# EAGLE design TDA2822M_SMD Version (EAGLE 7.0.0)
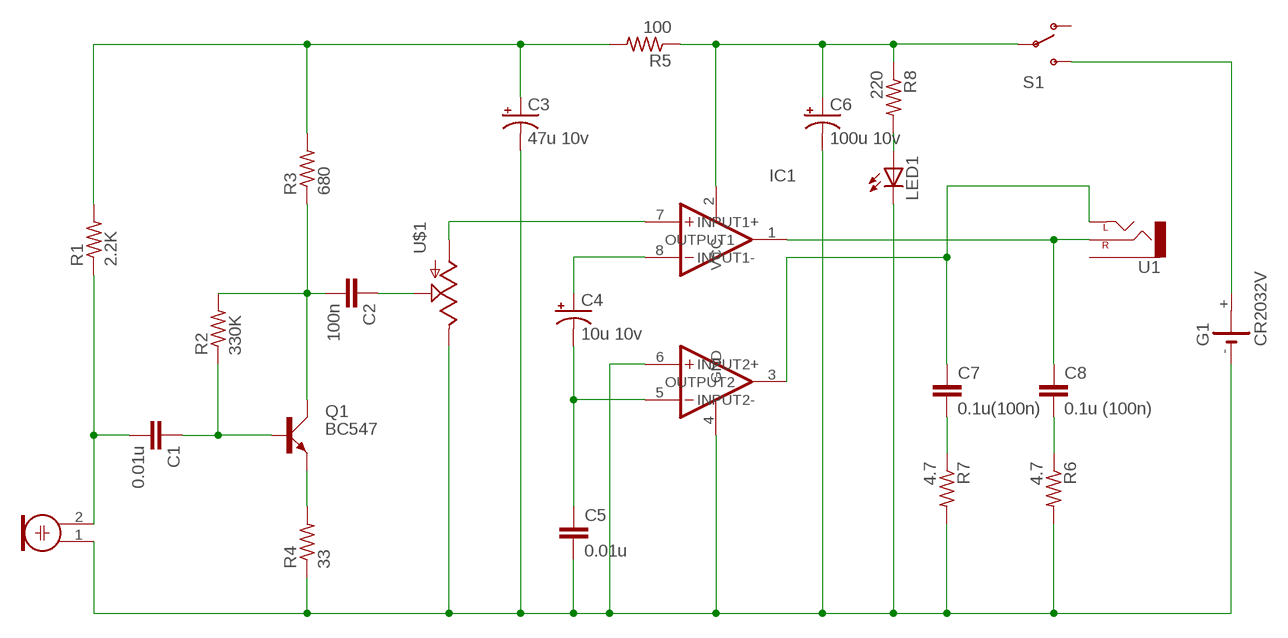
[diagram p0: schematic, sheet 1]

## Parts
C1  0.01u  CAP1206  [1206]
C2  100n  CAP0805  [0805]
C3  47u 10v  CAP_POLPTH2  [CPOL-RADIAL-10UF-25V]
C4  10u 10v  CAP_POLPTH2  [CPOL-RADIAL-10UF-25V]
C5  0.01u  CAP1206  [1206]
C6  100u 10v  CAP_POLPTH2  [CPOL-RADIAL-10UF-25V]
C7  0.1u(100n)  CAP1206  [1206]
C8  0.1u (100n)  CAP1206  [1206]
G1  CR2032V  [CR2032V]
IC1  TDA2822M  [DIL8]
LED1  LED3MM  [LED3MM]
M1  ELECTRET_MICROPHON-F6035AP  [F6035AP]
Q1  BC547  [SOT54A]
R1  2.2K  R-US_R1206  [R1206]
R2  330K  R-US_R1206  [R1206]
R3  680  R-US_R1206  [R1206]
R4  33  R-US_R1206  [R1206]
R5  100  R-US_R1206  [R1206]
R6  4.7  R-US_R1206  [R1206]
R7  4.7  R-US_R1206  [R1206]
R8  220  R-US_R1206  [R1206]
S1  SWITCH-SPSTKIT  [SWITCH-SPDT_KIT]
U1  AUDIO-JACKPTH  [AUDIO-JACK]
U$1  POT-RV16AF-20  [POT_ALPHA_RV16AF-20]

## Nets
GND: C3.2(-) C5.2 C6.2(-) G1.- IC1.4(GND) IC1.6(INPUT2+) LED1.K(C) M1.1 R4.1 R6.2 R7.2 U$1.3(E)
N$1: C3.1(+) R1.2 R3.2 R5.2
N$2: C2.2 Q1.C R2.2 R3.1
N$3: C1.2 M1.2 R1.1
N$5: Q1.E R4.2
N$6: C2.1 U$1.2(S)
N$8: C4.2(-) C5.1 IC1.5(INPUT2-)
N$9: C7.2 R7.1
N$10: C8.2 R6.1
N$11: LED1.A R8.2
N$12: C6.1(+) IC1.2(VCC) R5.1 R8.1 S1.2(P)
N$13: C8.1 IC1.1(OUTPUT1) U1.RING(RIGHT)
N$15: C1.1 Q1.B R2.1
N$16: C4.1(+) IC1.8(INPUT1-)
N$17: IC1.7(INPUT1+) U$1.1(A)
N$18: C7.1 IC1.3(OUTPUT2) U1.TIP(LEFT)
VCC: G1.+ S1.3(S)
Unconnected: G1.+@1(+) S1.1(O) U1.SLEEVE

## Library data of the parts
C1 C2 C5 C7 C8 = SparkFun:CAP: Capacitor Standard 0603 ceramic capacitor, and 0.1" leaded capacitor.
C3 C4 C6 = SparkFun:CAP_POL: Capacitor Polarized These are standard SMD and PTH capacitors. Normally 10uF, 47uF, and 100uF in electrolytic and tantalum varieties. Always verify the external diameter of the through hole cap, it varies with capacity, voltage, and manufacturer. The EIA devices should be standard.
G1 = battery:CR2032V: LI BATTERY Varta
IC1 = TDA2822M:TDA2822M: TDA2822M - DUAL LOW-VOLTAGE POWER AMPLIFIER
LED1 = adafruit:LED: LED OSRAM: - CHIPLED LG R971, LG N971, LY N971, LG Q971, LY Q971, LO R971, LY R971 LH N974, LH R974 LS Q976, LO Q976, LY Q976 LO Q996 - Hyper CHIPLED LW Q18S LB Q993, LB Q99A, LB R99A - SideLED LS A670, LO A670, LY A670, LG A670, LP A670 LB A673, LV A673, LT A673, LW A673 LH A674 LY A675 LS A676, LA A676, LO A676, LY A676, LW A676 LS A679, LY A679, LG A679 - Hyper Micro SIDELED® LS Y876, LA Y876, LO Y876, LY Y876 LT Y87S - SmartLED LW L88C, LW L88S LB L89C, LB L89S, LG L890 LS L89K, LO L89K, LY L89K LS L896, LA L896, LO L896, LY L896 - TOPLED LS T670, LO T670, LY T670, LG T670, LP T670 LSG T670, LSP T670, LSY T670, LOP T670, LYG T670 LG T671, LOG T671, LSG T671 LB T673, LV T673, LT T673, LW T673 LH T674 LS T676, LA T676, LO T676, LY T676, LB T676, LH T676, LSB T676, LW T676 LB T67C, LV T67C, LT T67C, LS T67K, LO T67K, LY T67K, LW E67C LS E67B, LA E67B, LO E67B, LY E67B, LB E67C, LV E67C, LT E67C LW T67C LS T679, LY T679, LG T679 LS T770, LO T770, LY T770, LG T770, LP T770 LB T773, LV T773, LT T773, LW T773 LH T774 LS E675, LA E675, LY E675, LS T675 LS T776, LA T776, LO T776, LY T776, LB T776 LHGB T686 LT T68C, LB T68C - Hyper Mini TOPLED® LB M676 - Mini TOPLED Santana® LG M470 LS M47K, LO M47K, LY M47K Source: http://www.osram.convergy.de/
M1 = microphon:ELECTRET_MICROPHON-: Electret Condenser Microphone
Q1 = transistor-small-signal:BC547: NPN TRANSISTOR
R1-R8 = adafruit:R-US_: RESISTOR, American symbol
S1 = SparkFun:SWITCH-SPST: SPST Switch Simple slide switch. Spark Fun Electronics SKU : COM-00102
U1 = SparkFun:AUDIO-JACK: 3.5mm Audio Jack Simple 3.5mm common PCB mount audio jack. SKU: PRT-08032
U$1 = SparkFun:POT

## Net classes
0 default: width 0.508 mm, drill 0.356 mm, clearance 0.762 mm

## Board
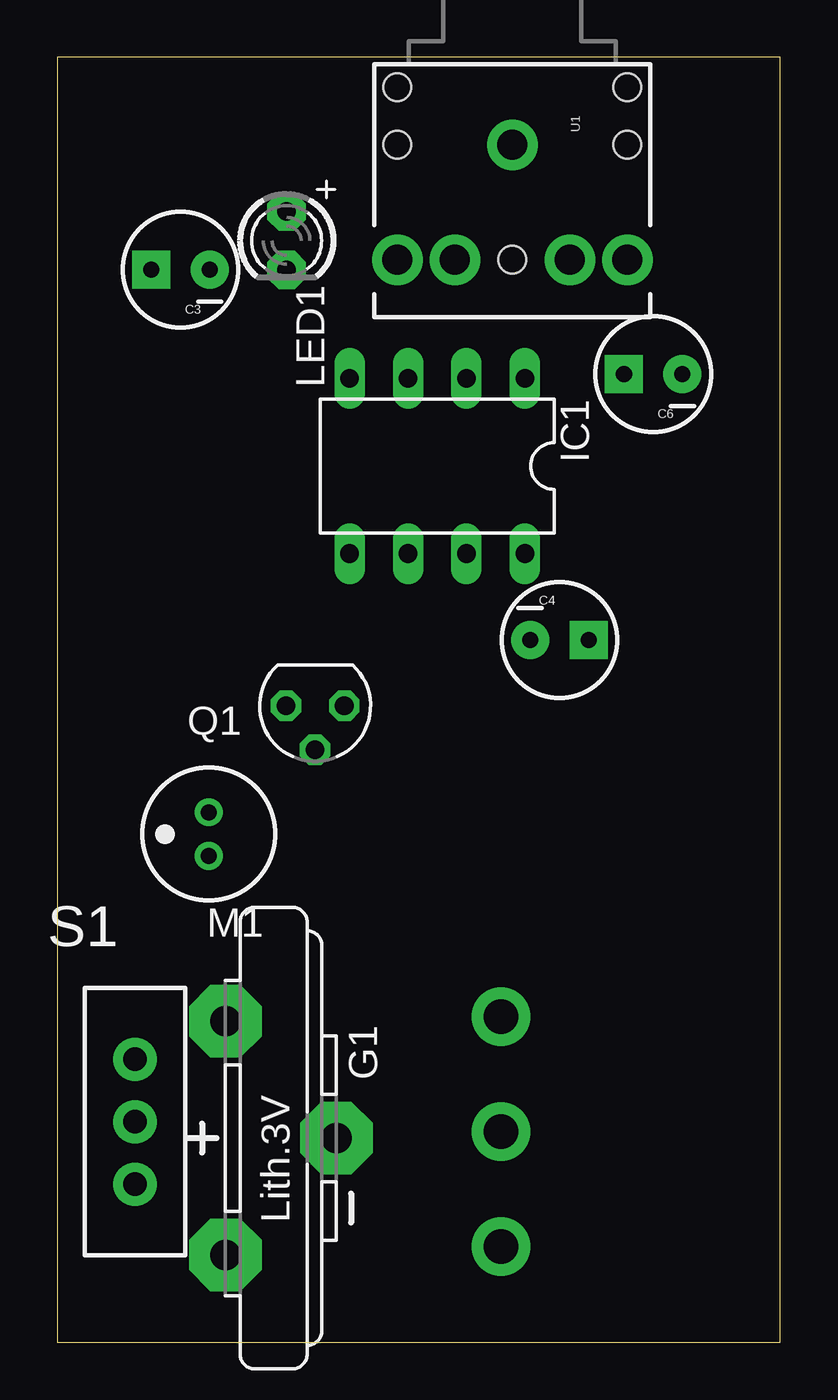
[diagram p1: board, top side]
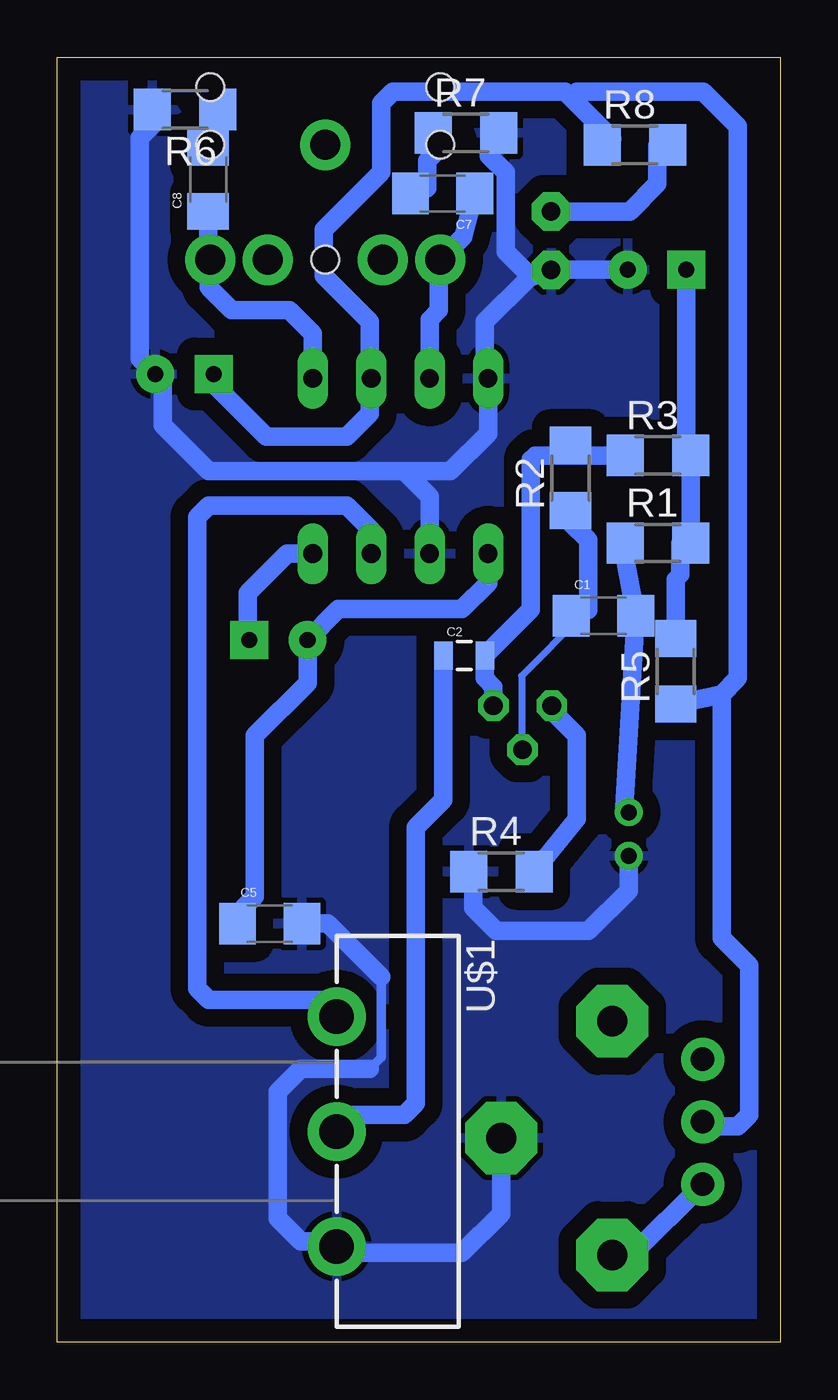
[diagram p2: board, bottom side, seen from below]

Size 31.42 x 55.87 mm. Coordinates in mm from the lower left corner, seen from the top.
Outline: 0,0 31.42,0 31.42,55.87 0,55.87 0,0
Copper layers (1*16): Top 0.035mm / dielectric 1.5mm / Bottom 0.035mm
Design rules "default *": minimum track width 10mil, minimum drill 24mil, track to track 8mil, track to pad 8mil, pad to pad 8mil, via to via 8mil, smd to smd 8mil, copper to edge 40mil, drill to drill 20mil, minimum pad ring 10mil, minimum via ring 8mil, stop-mask expansion 4mil, vias tented up to drill 0mil, thermal gap 10mil

### Footprints (pad centres in the part's own frame; a part is rotated, then mirrored left to right if it is on the bottom)
1206 = smd 1.6 x 1.8: 1 -1.4,0; 2 1.4,0
0805 = smd 0.8 x 1.2: 1 -0.9,0; 2 0.9,0
CPOL-RADIAL-10UF-25V = drill 0.7 pad 1.651 square: 1 1.27,0 | drill 0.7 pad 1.651: 2 -1.27,0
CR2032V = drill 1.321 pad 3.15 octagon: + -2.54,-5.08; +@1 -2.54,5.08; - 2.286,0
DIL8 = drill 0.813 long: 1 -3.81,-3.81; 2 -1.27,-3.81; 3 1.27,-3.81; 4 3.81,-3.81; 5 3.81,3.81; 6 1.27,3.81; 7 -1.27,3.81; 8 -3.81,3.81
LED3MM = drill 0.813 pad 1.676 octagon: A -1.27,0; K 1.27,0
F6035AP = drill 0.7 pad 1.2: 1 0,0.95; 2 0,-0.95
SOT54A = drill 0.813 octagon: B 0,1.905; C -1.27,0; E 1.27,0
R1206 = smd 1.6 x 1.803: 1 -1.422,0; 2 1.422,0
SWITCH-SPDT_KIT = drill 1.016 pad 1.88: 1 0,2.718; 2 0,0; 3 0,-2.718
AUDIO-JACK = drill 1.3 pad 2.184: RING 5,5; RSH 5,2.5; SLEEVE 0,0; TIP 5,-5; TSH 5,-2.5 | hole 1.2: 0,5; -2.5,5; -2.5,-5; 0,-5; 5,0
POT_ALPHA_RV16AF-20 = drill 1.5 pad 2.54: 1 -5,0; 2 0,0; 3 5,0

### Placement (x,y rotation side)
C1  7.68,31.59 0 bottom
C2  13.74,29.86 0 bottom
C3  5.35,46.64 180 top
C4  21.82,30.53 0 top
C5  22.19,18.2 0 bottom
C6  25.9,42.1 180 top
C7  14.68,49.95 180 bottom
C8  24.87,50.57 90 bottom
G1  9.84,8.87 0 top
IC1  16.51,38.1 180 top
LED1  9.96,47.9 270 top
M1  6.58,22.09 180 top
Q1  11.2,27.67 180 top
R1  5.31,34.75 0 bottom
R2  9.12,37.59 90 bottom
R3  5.31,38.56 0 bottom
R4  12.12,20.46 0 bottom
R5  4.54,29.17 90 bottom
R6  25.88,53.61 180 bottom
R7  13.66,52.59 0 bottom
R8  6.31,52.07 0 bottom
S1  3.37,9.58 0 top
U1  19.78,52.07 270 top
U$1  19.28,9.16 270 bottom

### Tracks (layer width: path | path; a pad name or v marks a point on that pad's centre or on a via)
GND
  Bottom 0.406: 17.34,15.87 17.34,12.37 17.84,11.87
  Bottom 0.813: 10.82,46.31 LED1.K C3.2 | 10.82,46.31 10.96,46.25 12.84,44.37 12.84,42.05 IC1.4 12.7,39.51 14.34,37.87 16.34,37.87 | R7.2 12.66,51.59 11.94,50.87 11.94,47.43 10.82,46.31 | R6.2 26.88,53.33 27.84,52.37 27.84,42.77 C6.2 26.84,41.77 26.84,39.87 24.84,37.87 16.34,37.87 | IC1.6 15.24,36.77 16.34,37.87 | G1.- 12.13,5.58 13.84,3.87 18.99,3.87 | M1.1 6.58,19.63 8.34,17.87 12.34,17.87 13.34,18.87 13.34,20.24 R4.1 | C5.2 19.67,18.2 17.34,15.87 | 17.84,11.87 20.84,11.87 21.84,10.87 21.84,5.37 20.84,4.37 19.84,4.37 19.34,3.87 19.34,4.1 U$1.3
  pour Bottom: 0,55.88 31.75,55.88 31.75,0 0,0
N$1
  Bottom 0.813: C3.1 4.08,38.79 R3.2 R1.2 4.34,34.72 4.34,33.37 4.54,33.17 R5.2
N$2
  Bottom 0.813: R3.1 9.15,38.56 | 9.15,38.56 R2.2 | Q1.C 12.47,28.5 12.84,28.87 C2.2 10.84,31.86 10.84,38.37 10.65,38.56 9.15,38.56
N$3
  Bottom 0.813: R1.1 6.78,34.28 C1.2 6.78,23.24 M1.2
N$5
  Bottom 0.813: Q1.E 9.93,27.46 8.84,26.37 8.84,22.74 R4.2
N$6
  Bottom 0.813: C2.1 14.64,23.57 15.84,22.37 15.84,10.37 16.34,9.87 18.57,9.87 U$1.2
N$8
  Bottom 0.813: IC1.5 12.7,33.01 13.84,31.87 19.21,31.87 C4.2 20.55,28.66 22.84,26.37 22.84,19.37 23.34,18.87 23.34,18.45 C5.1
N$9
  Bottom 0.813: R7.1 14.66,52.05 15.34,51.37 15.34,50.19 C7.2
N$10
  Bottom 0.406: R6.1 24.87,53.61
  Bottom 0.813: 24.87,53.61 C8.2
N$11
  Bottom 0.813: LED1.A 6.54,49.17 5.34,50.37 5.34,52.04 R8.2
N$12
  Bottom 0.813: R8.1 7.31,52.34 9.09,54.12 | 9.09,54.12 9.34,54.37 16.84,54.37 17.34,53.87 17.34,50.87 19.84,48.37 19.84,46.37 17.84,44.37 17.84,41.97 IC1.2 17.84,41.85 17.84,40.37 18.84,39.37 22.34,39.37 24.63,41.66 C6.1 | R5.1 2.54,28.17 | 2.54,28.17 1.84,28.87 1.84,52.87 3.34,54.37 8.84,54.37 9.09,54.12 | 2.54,28.17 2.54,17.57 1.34,16.37 1.34,9.87 1.84,9.37 3.16,9.37 S1.2
N$13
  Bottom 0.406: C8.1 24.78,49.67
  Bottom 0.813: C8.1 24.87,47.16 U1.RING 24.84,47.01 24.84,45.87 23.84,44.87 21.34,44.87 20.32,43.85 IC1.1
N$15
  Bottom 0.305: C1.1 8.62,31.59 11.24,28.97 11.24,25.81 Q1.B
  Bottom 0.813: R2.1 9.12,35.65 8.34,34.87 8.34,31.83 C1.1
N$16
  Bottom 0.813: IC1.8 21.42,34.29 23.14,32.57 23.14,30.58 C4.1
N$17
  Bottom 0.813: IC1.7 17.78,35.31 18.84,36.37 24.84,36.37 25.34,35.87 25.34,15.37 24.84,14.87 19.99,14.87 U$1.1
N$18
  Bottom 0.813: IC1.3 15.24,44.47 14.84,44.87 14.84,47.01 U1.TIP 13.77,48.08 C7.1
VCC
  Bottom 0.813: G1.+ 6.44,3.79 S1.3